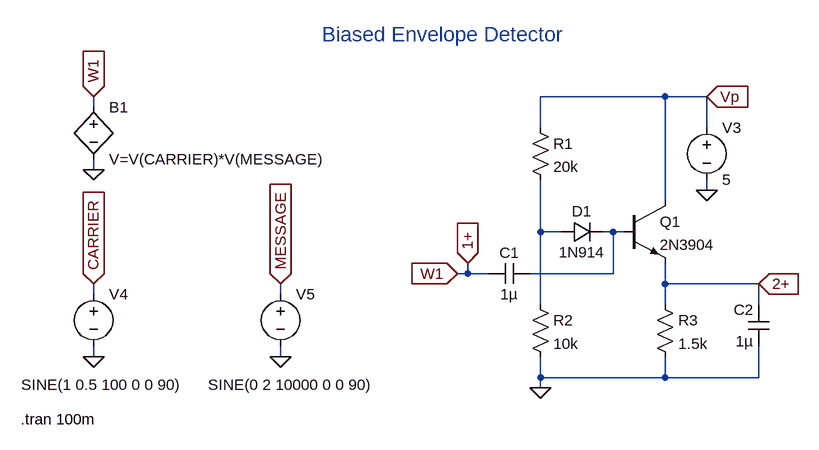
[diagram p0: schematic bias_env_detector_ltspice.asc]
bias_env_detector_ltspice.asc, the LTspice schematic file:
Version 4
SHEET 1 888 724
WIRE 448 112 256 112
WIRE 512 112 448 112
WIRE -432 128 -432 112
WIRE 256 160 256 112
WIRE 512 160 512 112
WIRE -432 224 -432 208
WIRE 512 256 512 240
WIRE 448 272 448 112
WIRE 256 320 256 240
WIRE 288 320 256 320
WIRE 368 320 352 320
WIRE 384 320 368 320
WIRE 144 384 144 368
WIRE 144 384 128 384
WIRE 176 384 144 384
WIRE 368 384 368 320
WIRE 368 384 240 384
WIRE 448 400 448 368
WIRE 592 400 448 400
WIRE -432 416 -432 400
WIRE -144 416 -144 400
WIRE 256 432 256 320
WIRE 448 432 448 400
WIRE 592 432 592 400
WIRE -432 512 -432 496
WIRE -144 512 -144 496
WIRE 256 544 256 512
WIRE 448 544 448 512
WIRE 448 544 256 544
WIRE 592 544 592 496
WIRE 592 544 448 544
WIRE 256 560 256 544
FLAG 128 384 W1
IOPIN 128 384 In
FLAG -432 224 0
FLAG -432 112 W1
IOPIN -432 112 In
FLAG 512 112 Vp
IOPIN 512 112 In
FLAG 256 560 0
FLAG 512 256 0
FLAG 144 368 1+
IOPIN 144 368 In
FLAG 592 400 2+
IOPIN 592 400 In
FLAG -432 512 0
FLAG -144 512 0
FLAG -432 400 CARRIER
IOPIN -432 400 In
FLAG -144 400 MESSAGE
IOPIN -144 400 In
SYMBOL bv -432 112 R0
SYMATTR InstName B1
SYMATTR Value V=V(CARRIER)*V(MESSAGE)
SYMBOL cap 608 496 R180
WINDOW 0 24 56 Left 2
WINDOW 3 24 8 Left 2
SYMATTR InstName C2
SYMATTR Value 1µ
SYMBOL res 240 144 R0
SYMATTR InstName R1
SYMATTR Value 20k
SYMBOL res 240 416 R0
SYMATTR InstName R2
SYMATTR Value 10k
SYMBOL res 432 416 R0
SYMATTR InstName R3
SYMATTR Value 1.5k
SYMBOL diode 288 336 R270
WINDOW 0 32 32 VTop 2
WINDOW 3 0 32 VBottom 2
SYMATTR InstName D1
SYMATTR Value 1N914
SYMBOL npn 384 272 R0
SYMATTR InstName Q1
SYMATTR Value 2N3904
SYMBOL voltage 512 144 R0
WINDOW 123 0 0 Left 0
WINDOW 39 0 0 Left 0
SYMATTR InstName V3
SYMATTR Value 5
SYMBOL cap 240 368 R90
WINDOW 0 0 32 VBottom 2
WINDOW 3 32 32 VTop 2
SYMATTR InstName C1
SYMATTR Value 1µ
SYMBOL voltage -432 400 R0
WINDOW 3 -111 155 Left 2
WINDOW 123 0 0 Left 0
WINDOW 39 0 0 Left 0
SYMATTR Value SINE(1 0.5 100 0 0 90)
SYMATTR InstName V4
SYMBOL voltage -144 400 R0
WINDOW 3 -112 155 Left 2
WINDOW 123 0 0 Left 0
WINDOW 39 0 0 Left 0
SYMATTR Value SINE(0 2 10000 0 0 90)
SYMATTR InstName V5
TEXT -80 16 Left 3 ;Biased Envelope Detector
TEXT -544 608 Left 2 !.tran 100m

The netlist it stands for:
* bias_env_detector_ltspice.asc
B1 1+ 0 V=V(CARRIER)*V(MESSAGE)
C2 0 2+ 1µ
R1 Vp N001 20k
R2 N001 0 10k
R3 2+ 0 1.5k
D1 N001 N002 1N914
Q1 Vp N002 2+ 0 2N3904
V3 Vp 0 5
C1 N002 1+ 1µ
V4 CARRIER 0 SINE(1 0.5 100 0 0 90)
V5 MESSAGE 0 SINE(0 2 10000 0 0 90)
.model D D
.lib standard.dio
.model NPN NPN
.model PNP PNP
.lib standard.bjt
* Biased Envelope Detector
.tran 100m
.backanno
.end